# EAGLE design saomr (EAGLE 7.6.0)
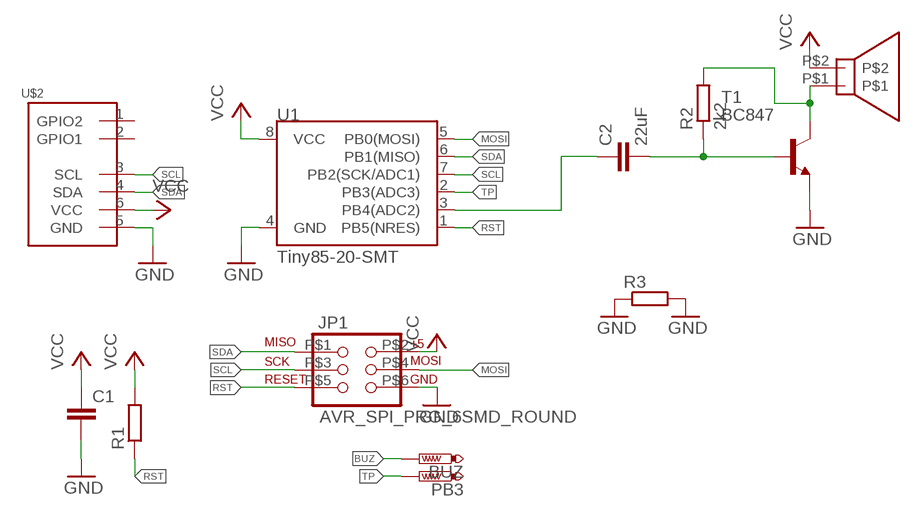
[diagram p0: schematic, sheet 1]

## Parts
BUZ  PTR1B2,54  [B2,54]
C1  C-EUC1206  [C1206]
C2  22uF  C-EUC1206  [C1206]
JP1  AVR_SPI_PRG_6SMD_ROUND  [2X3_SMD_PAD_ROUND]
PB3  PTR1B2,54  [B2,54]
R1  R-EU_R1206  [R1206]
R2  2k2  R-EU_R1206  [R1206]
R3  R-EU_M1206  [M1206]
T1  BC847  [SOT23]
U1  Tiny85-20-SMT  ATTINY45TINY85-20-SMT  [SO08-EIAJ]
U$1  SPEAKERKMTG-1102  [KMTG-1102]
U$2  SAO-SHITTY-ADDON  [2X3_SMD]

## Nets
BUZ: BUZ.TP C2.1 U1.3(PB4(ADC2))
GND: C1.2 JP1.P$6 R3.1 R3.2 T1.2(E) U1.4(GND) U$2.5(GND)
MOSI: JP1.P$4 U1.5(PB0(MOSI))
N$8: C2.2 R2.1 T1.1(B)
N$11: R2.2 T1.3(C) U$1.P$1
RST: JP1.P$5 R1.1 U1.1(PB5(NRES))
SCL: JP1.P$3 U1.7(PB2(SCK/ADC1)) U$2.3(SCL)
SDA: JP1.P$1 U1.6(PB1(MISO)) U$2.4(SDA)
TP: PB3.TP U1.2(PB3(ADC3))
VCC: C1.1 JP1.P$2 R1.2 U1.8(VCC) U$1.P$2 U$2.6(VCC)
Unconnected: U$2.1(GPIO2) U$2.2(GPIO1)

## Library data of the parts
BUZ PB3 = testpad:PTR1: TEST PIN
C1 = rcl:C-EU: CAPACITOR, European symbol
C2 = resistor:C-EU: CAPACITOR, European symbol
JP1 = SparkFun-Connectors:AVR_SPI_PRG_6: AVR ISP 6 Pin This is the reduced ISP connector for AVR programming. Common on Arduino. This footprint will take up less PCB space and can be used with a 10-pin to 6-pin adapter such as SKU: BOB-08508 **Special note about "TEST_POINT" package. The stop mask is on the top side, so if you want your programming test points to be on the bottom of your board, make sure to place this package on the bottom side of the board. This also ensure that the orientation to program from the bottom side will be correct.
R1 R2 = rcl:R-EU_: RESISTOR, European symbol
R3 = resistor:R-EU_: RESISTOR, European symbol
T1 = transistor:BC847: NPN TRANSISTOR
U1 = SparkFun-DigitalIC:ATTINY45: Atmel 8-pin 2/4/8kB flash uC; PROD_ID: IC-09092
U$1 = KMTG-1002:SPEAKER
U$2 = SparkFun-Connectors:SAO-SHITTY-ADDON

## Board
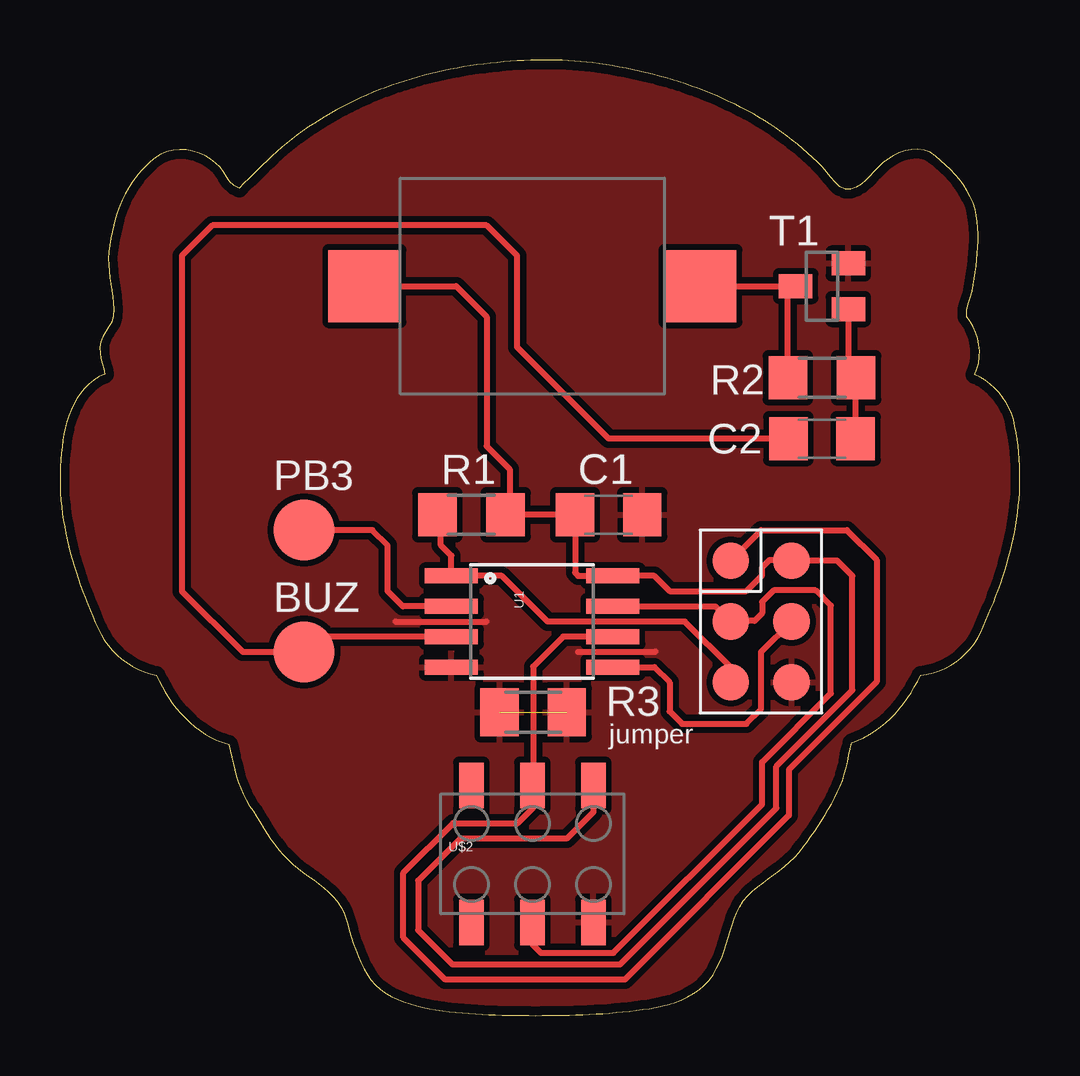
[diagram p1: board, top side]
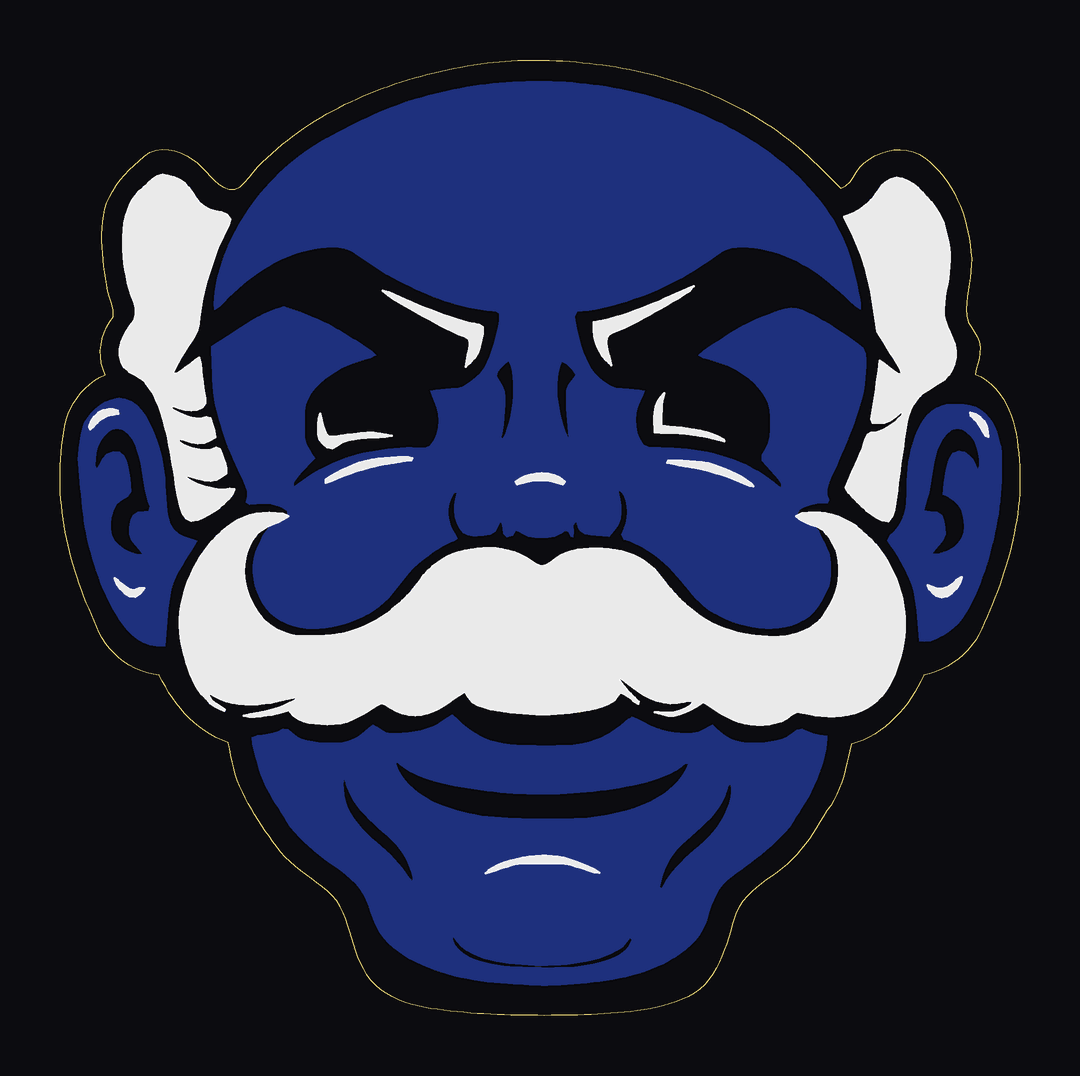
[diagram p2: board, bottom side, seen from below]

Size 40 x 39.81 mm. Coordinates in mm from the lower left corner, seen from the top.
Outline: 20.17,39.81 19.89,39.81 19.61,39.8 19.33,39.79 19.05,39.77 18.77,39.76 18.49,39.73 18.21,39.71 17.93,39.68 17.65,39.64 17.37,39.61 17.1,39.57 16.82,39.52 16.54,39.47 16.27,39.42 15.99,39.36 15.72,39.3 15.44,39.24 15.17,39.17 14.9,39.1 14.63,39.02 14.36,38.94 14.1,38.85 13.83,38.76 13.57,38.67 13.31,38.57 13.04,38.46 12.79,38.35 12.53,38.24 12.28,38.12 12.02,38 11.77,37.87 11.53,37.74 11.28,37.6 11.04,37.46 10.8,37.31 10.56,37.16 10.33,37 10.1,36.84 9.87,36.68 9.66,36.51 9.44,36.34 9.24,36.17 9.03,35.99 8.83,35.81 8.63,35.62 8.43,35.44 8.24,35.25 8.05,35.05 7.86,34.86 7.67,34.67 7.48,34.47 7.25,34.57 7.08,34.73 6.94,34.93 6.81,35.14 6.68,35.34 6.5,35.51 6.29,35.68 6.05,35.83 5.8,35.94 5.54,36.02 5.27,36.06 4.99,36.07 4.72,36.05 4.45,35.99 4.2,35.89 3.96,35.75 3.75,35.57 3.55,35.38 3.36,35.17 3.18,34.95 3.01,34.72 2.86,34.49 2.73,34.24 2.6,33.99 2.49,33.73 2.39,33.47 2.31,33.2 2.23,32.93 2.17,32.65 2.12,32.38 2.07,32.1 2.04,31.82 2.02,31.54 2.02,31.27 2.05,31.01 2.08,30.74 2.12,30.48 2.16,30.22 2.2,29.95 2.22,29.69 2.23,29.42 2.21,29.16 2.16,28.89 2.03,28.7 1.9,28.5 1.78,28.29 1.7,28.07 1.66,27.83 1.67,27.6 1.7,27.38 1.76,27.16 1.82,26.95 1.85,26.73 1.62,26.61 1.4,26.47 1.2,26.3 1.01,26.12 0.85,25.91 0.7,25.7 0.57,25.47 0.46,25.23 0.36,24.99 0.28,24.74 0.21,24.48 0.16,24.23 0.12,23.97 0.09,23.71 0.05,23.43 0.03,23.15 0.01,22.87 0,22.59 0,22.31 0.01,22.03 0.02,21.75 0.04,21.47 0.07,21.19 0.1,20.91 0.14,20.64 0.19,20.36 0.24,20.09 0.3,19.81 0.36,19.54 0.43,19.27 0.51,19 0.59,18.73 0.67,18.46 0.76,18.19 0.85,17.93 0.94,17.67 1.04,17.4 1.15,17.14 1.25,16.88 1.36,16.63 1.48,16.37 1.59,16.12 1.71,15.86 1.85,15.63 2.01,15.42 2.18,15.21 2.37,15.03 2.58,14.85 2.79,14.69 3.02,14.55 3.26,14.43 3.5,14.32 3.76,14.24 4.01,14.17 4.13,13.93 4.25,13.69 4.39,13.46 4.53,13.23 4.69,13.01 4.85,12.8 5.03,12.59 5.21,12.4 5.41,12.21 5.61,12.04 5.83,11.88 6.05,11.73 6.28,11.59 6.53,11.48 6.78,11.38 7.03,11.29 7.09,11.03 7.15,10.76 7.21,10.5 7.28,10.24 7.35,9.98 7.43,9.72 7.53,9.47 7.64,9.22 7.76,8.98 7.89,8.74 8.05,8.52 8.19,8.28 8.33,8.05 8.48,7.81 8.63,7.58 8.79,7.35 8.95,7.13 9.12,6.91 9.3,6.7 9.49,6.5 9.69,6.31 9.9,6.13 10.12,5.96 10.35,5.81 10.57,5.66 10.78,5.5 10.99,5.33 11.19,5.15 11.37,4.96 11.54,4.76 11.69,4.54 11.82,4.31 11.92,4.06 11.98,3.8 12.06,3.53 12.14,3.26 12.23,3 12.32,2.73 12.42,2.47 12.53,2.21 12.65,1.96 12.8,1.72 12.96,1.49 13.14,1.28 13.34,1.09 13.57,0.92 13.81,0.79 14.07,0.67 14.33,0.58 14.59,0.49 14.85,0.41 15.12,0.35 15.39,0.29 15.67,0.24 15.94,0.2 16.21,0.16 16.49,0.13 16.76,0.11 17.04,0.09 17.32,0.07 17.59,0.05 17.87,0.04 18.15,0.03 18.42,0.01 18.7,0.01 18.98,0 19.26,0 19.54,0 19.82,0 20.1,0 20.38,0 20.66,0.01 20.94,0.01 21.22,0.02 21.5,0.03 21.78,0.04 22.06,0.05 22.34,0.06 22.62,0.08 22.89,0.1 23.17,0.13 23.45,0.15 23.73,0.18 24.01,0.21 24.28,0.25 24.56,0.29 24.84,0.34 25.11,0.4 25.38,0.47 25.65,0.56 25.91,0.66 26.17,0.78 26.41,0.92 26.64,1.08 26.85,1.26 27.04,1.47 27.21,1.69 27.35,1.94 27.47,2.19 27.58,2.44 27.68,2.7 27.76,2.97 27.84,3.24 27.92,3.5 28.01,3.77 28.1,4.03 28.21,4.29 28.33,4.54 28.48,4.77 28.65,4.99 28.85,5.19 29.07,5.36 29.29,5.53 29.52,5.7 29.75,5.87 29.97,6.04 30.19,6.22 30.4,6.4 30.61,6.6 30.8,6.8 30.97,7.02 31.13,7.24 31.29,7.46 31.44,7.68 31.59,7.91 31.74,8.13 31.88,8.36 32.01,8.59 32.15,8.83 32.27,9.07 32.39,9.31 32.51,9.55 32.61,9.8 32.69,10.06 32.76,10.32 32.82,10.58 32.87,10.84 32.93,11.11 32.99,11.37 33.25,11.47 33.5,11.58 33.74,11.71 33.97,11.86 34.19,12.02 34.4,12.2 34.6,12.39 34.8,12.58 34.98,12.79 35.15,13 35.31,13.23 35.46,13.46 35.6,13.69 35.73,13.93 35.86,14.18 36.12,14.21 36.38,14.27 36.64,14.36 36.88,14.46 37.11,14.59 37.34,14.74 37.55,14.9 37.74,15.09 37.92,15.28 38.09,15.49 38.23,15.72 38.36,15.95 38.48,16.19 38.57,16.44 38.68,16.7 38.79,16.95 38.9,17.21 39,17.47 39.1,17.73 39.19,17.99 39.28,18.25 39.37,18.52 39.45,18.78 39.52,19.05 39.59,19.32 39.66,19.59 39.72,19.86 39.77,20.14 39.82,20.41 39.86,20.69 39.9,20.96 39.93,21.24 39.96,21.51 39.98,21.79 39.99,22.07 40,22.35 40,22.63 39.99,22.9 39.98,23.18 39.95,23.46 39.92,23.74 39.89,24.01 39.84,24.29 39.79,24.56 39.73,24.83 39.65,25.07 39.55,25.31 39.43,25.53 39.29,25.75 39.13,25.95 38.96,26.14 38.76,26.31 38.56,26.46 38.34,26.59 38.11,26.7 38.2,26.94 38.27,27.18 38.31,27.44 38.31,27.7 38.29,27.96 38.24,28.21 38.16,28.46 38.06,28.69 37.93,28.92 37.78,29.12 37.79,29.39 37.85,29.66 37.93,29.91 38.01,30.17 38.04,30.44 38.09,30.7 38.13,30.96 38.17,31.23 38.2,31.49 38.23,31.75 38.25,32.02 38.26,32.28 38.26,32.55 38.25,32.81 38.22,33.08 38.18,33.34 38.13,33.6 38.06,33.86 37.94,34.11 37.8,34.35 37.65,34.59 37.48,34.82 37.3,35.03 37.12,35.24 36.92,35.44 36.71,35.62 36.49,35.8 36.26,35.96 36.01,36.05 35.74,36.09 35.48,36.08 35.21,36.03 34.96,35.95 34.72,35.83 34.5,35.69 34.28,35.52 34.09,35.34 33.91,35.15 33.74,34.97 33.57,34.79 33.39,34.64 33.18,34.51 32.95,34.43 32.71,34.44 32.49,34.54 32.29,34.73 32.11,34.93 31.94,35.14 31.76,35.36 31.58,35.56 31.37,35.74 31.16,35.93 30.95,36.11 30.74,36.29 30.52,36.47 30.29,36.64 30.07,36.81 29.83,36.97 29.6,37.13 29.36,37.28 29.12,37.42 28.88,37.56 28.63,37.7 28.38,37.83 28.13,37.96 27.87,38.08 27.62,38.2 27.36,38.31 27.1,38.42 26.84,38.53 26.57,38.63 26.31,38.72 26.04,38.81 25.77,38.9 25.5,38.98 25.23,39.06 24.96,39.14 24.69,39.21 24.42,39.28 24.14,39.34 23.87,39.4 23.59,39.46 23.31,39.52 23.03,39.57 22.76,39.61 22.48,39.66 22.2,39.7 21.95,39.73 21.69,39.75 21.44,39.77 21.19,39.79 20.93,39.8 20.68,39.81 20.43,39.81 20.17,39.81
Copper layers (1*16): Top 0.0356mm / dielectric 1.5011mm / Bottom 0.0356mm
Design rules "LaenPCBOrder *": minimum track width 6mil, minimum drill 13mil, track to track 6mil, track to pad 6mil, pad to pad 6mil, via to via 6mil, smd to smd 6mil, copper to edge 15mil, drill to drill 6mil, minimum pad ring 7mil, minimum via ring 7mil, stop-mask expansion 3mil, vias tented up to drill 200mil, thermal gap 10mil

### Footprints (pad centres in the part's own frame; a part is rotated, then mirrored left to right if it is on the bottom)
B2,54 = smd 2.54 x 2.54: TP 0,0
C1206 = smd 1.6 x 1.8: 1 -1.4,0; 2 1.4,0
2X3_SMD_PAD_ROUND = smd 1.524 x 1.524: P$1 -1.27,2.54; P$2 1.27,2.54; P$3 -1.27,0; P$4 1.27,0; P$5 -1.27,-2.54; P$6 1.27,-2.54
R1206 = smd 1.6 x 1.803: 1 -1.422,0; 2 1.422,0
M1206 = smd 1.6 x 2: 1 -1.4,0; 2 1.4,0
SOT23 = smd 1 x 1.4: 1 -0.95,-1.1; 2 0.95,-1.1; 3 0,1.1
SO08-EIAJ = smd 0.61 x 2.21: 1 -1.905,-3.378; 2 -0.635,-3.378; 3 0.635,-3.378; 4 1.905,-3.378; 5 1.905,3.353; 6 0.635,3.353; 7 -0.635,3.353; 8 -1.905,3.353
KMTG-1102 = smd 3 x 3: P$1 -7,0; P$2 7,0
2X3_SMD = smd 1.02 x 1.9: 1 -2.54,-2.85; 2 -2.54,2.85; 3 0,-2.85; 4 0,2.85; 5 2.54,-2.85; 6 2.54,2.85

### Placement (x,y rotation side)
BUZ  10.16,15.15 0 top
C1  22.86,20.86 0 top
C2  31.75,24.04 0 top
JP1  29.21,16.42 0 top
PB3  10.16,20.23 0 top
R1  17.14,20.86 0 top
R2  31.75,26.58 180 top
R3  19.71,12.63 0 top
T1  31.75,30.39 90 top
U1  19.68,16.42 270 top
U$1  19.68,30.39 180 top
U$2  19.68,6.73 0 top
U$3  [DAVEDARKO_GOLD]  12.39,9.24 0 top

### Tracks (layer width: path | path; a pad name or v marks a point on that pad's centre or on a via)
BUZ
  Top 0.254: U1.3 10.79,15.78 BUZ.TP 7.62,15.15 5.08,17.69 5.08,31.66 6.35,32.93 17.78,32.93 19.05,31.66 19.05,27.85 22.86,24.04 C2.1
GND  (1 unrouted)
  Top 0.254: 21.59,15.15 24.78,15.15 24.8,15.17 | 13.97,16.42 17.78,16.42
  pour Top (isolate 0.254): -1.27,41.82 40.64,41.82 40.64,-0.09 -1.27,-0.09
MOSI
  Top 0.254: U1.5 24.76,14.51 25.4,13.88 25.4,12.67 25.92,12.15 28.59,12.15 29.21,12.77 29.21,15.15 JP1.P$4
N$1
  pour Bottom: 20.04,38.93 19.76,38.93 19.48,38.93 19.2,38.92 18.92,38.9 18.64,38.88 18.36,38.85 18.08,38.82 17.8,38.79 17.52,38.75 17.24,38.71 16.96,38.66 16.69,38.61 16.41,38.55 16.14,38.49 15.86,38.43 15.59,38.36 15.32,38.28 15.05,38.2 14.78,38.12 14.51,38.03 14.25,37.94 13.98,37.84 13.72,37.74 13.46,37.64 13.2,37.53 12.95,37.41 12.69,37.29 12.44,37.17 12.19,37.04 11.94,36.9 11.7,36.77 11.45,36.62 11.21,36.47 10.98,36.32 10.75,36.16 10.52,36 10.29,35.83 10.07,35.66 9.85,35.48 9.64,35.3 9.43,35.11 9.23,34.92 9.03,34.72 8.83,34.51 8.65,34.3 8.46,34.09 8.29,33.87 8.12,33.64 7.96,33.41 7.81,33.17 7.67,32.94 7.55,32.71 7.43,32.47 7.31,32.22 7.21,31.98 7.13,31.73 7.06,31.48 6.99,31.23 6.92,30.97 6.86,30.72 6.81,30.46 6.75,30.21 6.7,29.95 6.66,29.69 6.65,29.44 6.87,29.58 7.07,29.76 7.27,29.94 7.47,30.13 7.67,30.31 7.88,30.49 8.09,30.66 8.31,30.82 8.53,30.98 8.76,31.13 9,31.27 9.24,31.4 9.49,31.52 9.74,31.62 10,31.72 10.26,31.8 10.52,31.87 10.79,31.92 11.06,31.96 11.3,31.99 11.55,32 11.8,31.99 12.04,31.96 12.28,31.89 12.5,31.78 12.7,31.64 12.93,31.48 13.16,31.32 13.4,31.17 13.64,31.02 13.88,30.87 14.12,30.73 14.37,30.59 14.62,30.46 14.87,30.34 15.12,30.22 15.37,30.12 15.62,30.02 15.87,29.92 16.13,29.83 16.39,29.75 16.64,29.67 16.9,29.59 17.17,29.52 17.43,29.46 17.69,29.41 17.96,29.36 18.23,29.34 18.47,29.31 18.57,29.11 18.54,28.87 18.49,28.63 18.43,28.38 18.37,28.13 18.29,27.89 18.22,27.64 18.12,27.4 18.01,27.17 17.88,26.95 17.78,26.82 18.58,26.82 18.65,26.92 18.85,27.11 19.09,27.24 19.11,27.23 19.2,27.02 19.24,26.82 21.14,26.82 21.14,26.84 21.19,27.07 21.31,27.28 21.48,27.15 21.63,27 21.78,26.83 21.78,26.82 22.43,26.82 22.29,27 22.18,27.23 22.08,27.47 21.99,27.72 21.91,27.96 21.84,28.21 21.77,28.47 21.72,28.72 21.68,28.97 21.68,29.23 21.8,29.33 21.96,29.34 22.22,29.36 22.47,29.4 22.72,29.45 22.97,29.5 23.22,29.56 23.47,29.62 23.72,29.69 23.96,29.77 24.21,29.86 24.46,29.95 24.7,30.05 24.95,30.15 25.19,30.26 25.43,30.38 25.66,30.49 25.9,30.62 26.13,30.74 26.36,30.88 26.58,31.01 26.81,31.15 27.03,31.3 27.25,31.44 27.46,31.6 27.67,31.74 27.9,31.86 28.14,31.95 28.39,31.99 28.64,32 28.9,31.99 29.15,31.96 29.42,31.92 29.7,31.87 29.97,31.8 30.23,31.71 30.49,31.62 30.75,31.51 31,31.39 31.25,31.26 31.49,31.12 31.72,30.97 31.95,30.81 32.17,30.64 32.39,30.47 32.6,30.28 32.8,30.1 33,29.9 33.18,29.73 33.35,29.56 33.55,29.41 33.58,29.65 33.56,29.9 33.53,30.15 33.49,30.4 33.44,30.65 33.38,30.9 33.31,31.16 33.22,31.42 33.13,31.68 33.03,31.94 32.92,32.19 32.8,32.44 32.68,32.68 32.54,32.92 32.41,33.16 32.26,33.39 32.11,33.62 31.95,33.85 31.78,34.07 31.61,34.28 31.43,34.49 31.25,34.7 31.06,34.89 30.86,35.09 30.66,35.28 30.46,35.46 30.25,35.64 30.03,35.8 29.81,35.96 29.59,36.11 29.36,36.26 29.13,36.4 28.89,36.54 28.66,36.68 28.42,36.81 28.18,36.94 27.94,37.06 27.7,37.18 27.45,37.3 27.2,37.41 26.96,37.53 26.71,37.63 26.46,37.74 26.21,37.84 25.95,37.94 25.7,38.03 25.44,38.11 25.18,38.19 24.91,38.27 24.65,38.34 24.38,38.41 24.12,38.47 23.85,38.53 23.58,38.59 23.31,38.64 23.05,38.69 22.77,38.73 22.5,38.77 22.23,38.81 21.96,38.84 21.69,38.86 21.41,38.89 21.14,38.9 20.87,38.92 20.59,38.93 20.32,38.93
N$2
  pour Bottom: 30.68,29.55 30.44,29.47 30.2,29.39 29.96,29.3 29.73,29.22 29.51,29.12 29.29,29.03 29.07,28.93 28.85,28.82 28.64,28.7 28.4,28.57 28.17,28.43 27.94,28.29 27.71,28.15 27.48,28 27.25,27.85 27.03,27.7 26.83,27.52 27.07,27.4 27.32,27.32 27.58,27.24 27.83,27.16 28.08,27.05 28.32,26.94 28.55,26.81 28.78,26.66 28.99,26.5 29.19,26.33 29.38,26.14 29.54,25.92 29.68,25.69 29.77,25.45 29.82,25.18 29.83,24.92 29.83,24.65 29.83,24.37 29.82,24.09 29.75,23.81 29.61,23.57 29.5,23.39 29.39,23.22 29.53,23.08 29.66,22.94 29.79,22.8 29.96,22.61 30.13,22.42 30.28,22.21 30.29,22.02 30.06,22.15 29.86,22.3 29.63,22.47 29.4,22.62 29.16,22.77 28.91,22.9 28.66,23.02 28.4,23.12 28.14,23.22 27.88,23.31 27.61,23.39 27.36,23.44 27.11,23.49 26.85,23.54 26.6,23.57 26.34,23.61 26.09,23.63 25.83,23.66 25.57,23.67 25.31,23.68 25.06,23.66 24.79,23.65 24.55,23.77 24.39,23.99 24.28,24.24 24.22,24.51 24.2,24.79 24.22,25.06 24.28,25.33 24.38,25.59 24.47,25.81 24.56,26.04 24.35,26.08 24.13,26.1 23.92,26.12 23.69,26.13 23.47,26.15 23.25,26.2 23.05,26.31 22.86,26.44 22.65,26.6 22.45,26.79 22.44,26.81 21.78,26.81 21.83,26.63 21.69,26.43 21.57,26.22 21.5,25.99 21.47,25.75 21.47,25.47 21.48,25.19 21.51,24.92 21.54,24.64 21.58,24.36 21.64,24.09 21.55,24.02 21.44,24.23 21.34,24.48 21.27,24.75 21.2,25.01 21.15,25.28 21.12,25.56 21.09,25.83 21.09,26.1 21.09,26.35 21.11,26.59 21.13,26.81 19.24,26.81 19.25,26.78 19.28,26.55 19.3,26.31 19.3,26.07 19.29,25.83 19.26,25.58 19.22,25.32 19.17,25.08 19.11,24.83 19.05,24.58 18.97,24.34 18.86,24.11 18.78,24.07 18.8,24.28 18.83,24.53 18.85,24.78 18.87,25.04 18.88,25.29 18.89,25.55 18.89,25.8 18.88,26.06 18.8,26.27 18.66,26.46 18.56,26.57 18.49,26.69 18.57,26.81 17.78,26.81 17.73,26.75 17.54,26.57 17.34,26.41 17.11,26.26 16.85,26.16 16.58,26.13 16.3,26.12 16.08,26.1 15.87,26.08 15.66,26.03 15.75,25.81 15.85,25.6 15.95,25.35 16.01,25.09 16.03,24.82 16.02,24.55 15.96,24.29 15.86,24.04 15.72,23.81 15.49,23.7 15.22,23.68 14.96,23.67 14.7,23.66 14.42,23.65 14.14,23.63 13.86,23.61 13.58,23.57 13.3,23.53 13.03,23.48 12.76,23.42 12.49,23.35 12.22,23.27 11.95,23.18 11.69,23.07 11.44,22.96 11.19,22.83 10.95,22.7 10.71,22.55 10.48,22.38 10.26,22.21 10.09,22.08 9.92,21.97 9.92,22.15 10.05,22.34 10.2,22.52 10.36,22.69 10.55,22.9 10.73,23.12 10.74,23.37 10.58,23.6 10.47,23.86 10.41,24.13 10.39,24.41 10.39,24.69 10.39,24.96 10.41,25.22 10.46,25.48 10.57,25.73 10.71,25.95 10.88,26.16 11.06,26.35 11.26,26.52 11.47,26.68 11.7,26.82 11.93,26.95 12.17,27.07 12.42,27.16 12.67,27.25 12.92,27.32 13.17,27.39 13.39,27.51 13.18,27.69 12.95,27.86 12.71,28.01 12.48,28.17 12.24,28.32 12,28.47 11.76,28.61 11.52,28.75 11.27,28.89 11.02,29 10.77,29.11 10.51,29.21 10.25,29.3 10.02,29.38 9.79,29.45 9.55,29.49 9.31,29.47 9.08,29.4 8.86,29.3 8.64,29.19 8.39,29.06 8.15,28.92 7.92,28.77 7.68,28.62 7.45,28.47 7.21,28.32 6.98,28.16 6.76,28 6.54,27.82 6.45,27.58 6.43,27.32 6.43,27.07 6.44,26.81 6.47,26.55 6.49,26.3 6.54,26.02 6.6,25.75 6.67,25.47 6.75,25.21 6.84,24.94 6.93,24.67 7.03,24.41 7.13,24.15 7.24,23.89 7.35,23.63 7.46,23.37 7.57,23.11 7.69,22.85 7.8,22.6 7.9,22.38 7.98,22.16 8.04,21.93 8.05,21.69 7.98,21.47 8.03,21.35 8.2,21.35 8.47,21.32 8.73,21.26 8.99,21.19 9.22,21.06 9.32,20.81 9.15,20.67 8.96,20.55 8.76,20.45 8.55,20.38 8.4,20.22 8.33,20.04 8.25,19.87 8.16,19.69 8.06,19.49 7.97,19.28 7.92,19.05 7.91,18.82 7.91,18.59 7.91,18.36 7.92,18.13 7.98,17.9 8.06,17.68 8.17,17.47 8.29,17.23 8.44,17.01 8.61,16.8 8.8,16.62 9.02,16.46 9.26,16.34 9.51,16.24 9.78,16.18 10.05,16.13 10.33,16.12 10.6,16.12 10.88,16.14 11.15,16.18 11.42,16.23 11.69,16.3 11.95,16.39 12.21,16.5 12.46,16.61 12.7,16.75 12.94,16.9 13.16,17.06 13.33,17.21 13.49,17.37 13.64,17.54 13.79,17.71 13.93,17.89 14.09,18.09 14.25,18.28 14.42,18.47 14.6,18.65 14.78,18.83 14.98,18.99 15.17,19.15 15.38,19.3 15.6,19.43 15.82,19.56 16.04,19.66 16.27,19.76 16.5,19.83 16.6,20.02 16.49,20.28 16.41,20.5 16.36,20.74 16.35,20.98 16.36,21.22 16.4,21.45 16.49,21.67 16.59,21.81 16.73,21.9 16.73,21.78 16.67,21.51 16.64,21.24 16.64,20.97 16.66,20.69 16.76,20.43 16.92,20.2 17.03,20.08 17.13,19.96 17.39,19.97 17.66,19.99 17.88,20.01 18.11,20.05 18.3,20.18 18.38,20.31 18.42,20.45 18.49,20.62 18.63,20.43 18.62,20.16 18.63,19.93 18.7,19.95 18.79,20.13 18.96,20.19 19.14,20.08 19.39,19.95 19.66,19.9 19.94,19.9 20.22,19.9 20.49,19.95 20.74,20.08 20.87,20.16 21.02,20.19 21.15,19.99 21.37,19.93 21.51,20.08 21.54,20.3 21.56,20.5 21.68,20.57 21.76,20.38 21.88,20.16 22.1,20.03 22.35,19.98 22.61,19.97 22.81,19.97 23,20 23.17,20.1 23.34,20.3 23.46,20.53 23.53,20.77 23.56,21.03 23.55,21.29 23.5,21.54 23.45,21.79 23.59,21.77 23.72,21.55 23.8,21.33 23.85,21.1 23.84,20.87 23.81,20.63 23.73,20.41 23.63,20.2 23.54,20.03 23.45,19.86 23.62,19.77 23.79,19.68 23.96,19.59 24.2,19.46 24.44,19.32 24.66,19.16 24.88,18.99 25.09,18.82 25.29,18.63 25.49,18.44 25.66,18.23 25.83,18.01 25.99,17.8 26.16,17.59 26.33,17.39 26.52,17.2 26.73,17.03 26.94,16.87 27.17,16.73 27.41,16.6 27.65,16.49 27.9,16.39 28.15,16.31 28.41,16.24 28.67,16.18 28.94,16.14 29.2,16.12 29.47,16.11 29.74,16.12 30.01,16.16 30.27,16.22 30.52,16.31 30.76,16.43 30.99,16.57 31.19,16.75 31.37,16.94 31.53,17.16 31.66,17.39 31.77,17.64 31.85,17.91 31.92,18.18 31.95,18.46 31.95,18.74 31.91,19.02 31.85,19.3 31.75,19.56 31.62,19.81 31.53,20 31.41,20.18 31.27,20.34 31.09,20.49 30.9,20.6 30.69,20.7 30.49,20.8 30.5,21.02 30.69,21.13 30.84,21.19 30.99,21.24 31.19,21.29 31.4,21.32 31.61,21.32 31.83,21.3 32.09,21.28 32.25,21.39 32.18,21.61 32.18,21.84 32.25,22.07 32.35,22.28 32.45,22.49 32.56,22.72 32.66,22.95 32.77,23.18 32.87,23.42 32.96,23.65 33.05,23.89 33.13,24.13 33.21,24.38 33.28,24.62 33.35,24.86 33.43,25.13 33.5,25.41 33.56,25.68 33.6,25.96 33.62,26.24 33.63,26.52 33.64,26.8 33.65,27.07 33.66,27.34 33.67,27.61 33.68,27.88 33.48,28.01 33.28,28.14 33.09,28.27 32.89,28.39 32.67,28.54 32.44,28.69 32.21,28.83 31.98,28.97 31.75,29.11 31.51,29.23 31.27,29.35 31.01,29.44 30.85,29.5
N$3
  pour Bottom: 37.55,25.74 37.28,25.7 37.03,25.59 36.81,25.42 36.62,25.22 36.45,24.99 36.31,24.76 36.19,24.51 36.09,24.25 35.99,23.99 35.9,23.73 35.82,23.47 35.76,23.2 35.71,22.93 35.67,22.65 35.64,22.38 35.63,22.11 35.61,21.83 35.6,21.56 35.58,21.29 35.55,21.02 35.5,20.76 35.5,20.73 37,20.73 36.96,20.83 36.75,20.99 36.49,21.02 36.27,21.03 36.25,21.22 36.32,21.42 36.39,21.68 36.44,21.94 36.48,22.2 36.52,22.46 36.56,22.73 36.61,23 36.67,23.26 36.75,23.52 36.85,23.77 36.98,24.01 37.14,24.23 37.35,24.39 37.61,24.45 37.82,24.4 38.01,24.29 38.2,24.12 38.35,23.91 38.44,23.67 38.5,23.42 38.54,23.17 38.54,22.92 38.46,22.74 38.35,22.96 38.23,23.2 38.04,23.4 37.79,23.52 37.52,23.49 37.35,23.32 37.24,23.1 37.18,22.86 37.13,22.62 37.1,22.38 37.06,22.1 37.05,21.83 37.2,21.61 37.44,21.47 37.65,21.3 37.79,21.07 37.86,20.81 37.88,20.73 39,20.73 39.02,20.89 39.05,21.16 39.08,21.42 39.1,21.69 39.12,21.95 39.15,22.22 39.17,22.48 39.2,22.74 39.22,23 39.23,23.18 39.23,23.36 39.2,23.63 39.16,23.91 39.11,24.18 39.05,24.45 39.01,24.59 38.97,24.73 38.83,24.93 38.68,25.11 38.5,25.28 38.32,25.44 38.11,25.56 37.89,25.66 37.65,25.72
N$4
  pour Bottom: 2.87,25.48 2.71,25.47 2.55,25.47 2.32,25.46 2.08,25.44 1.86,25.36 1.66,25.24 1.47,25.09 1.3,24.92 1.16,24.72 1.04,24.51 0.96,24.28 0.9,24.04 0.86,23.87 0.81,23.7 0.77,23.46 0.78,23.25 0.78,23.04 0.78,22.83 0.78,22.55 0.78,22.28 0.79,22 0.81,21.73 0.84,21.46 0.85,21.37 2.65,21.37 2.72,21.43 2.91,21.56 3.06,21.63 3.2,21.7 3.18,21.94 3.15,22.18 3.12,22.45 3.07,22.71 3.01,22.97 2.92,23.22 2.77,23.45 2.56,23.53 2.33,23.48 2.13,23.35 1.97,23.17 1.87,22.96 1.77,22.74 1.67,22.91 1.68,23.16 1.71,23.41 1.77,23.67 1.87,23.91 2.02,24.12 2.21,24.29 2.41,24.4 2.62,24.45 2.88,24.38 3.08,24.21 3.24,24.01 3.36,23.79 3.46,23.55 3.54,23.31 3.6,23.06 3.64,22.81 3.68,22.56 3.71,22.3 3.76,22.04 3.81,21.78 3.88,21.53 3.93,21.37 4.73,21.37 4.72,21.45 4.7,21.73 4.7,22.01 4.7,22.27 4.68,22.54 4.66,22.8 4.62,23.06 4.58,23.32 4.52,23.58 4.46,23.83 4.37,24.08 4.28,24.33 4.16,24.57 4.03,24.79 3.87,25 3.68,25.19 3.46,25.33 3.27,25.42 3.08,25.46
N$5
  pour Bottom: 0.85,21.36 0.87,21.18 0.91,20.91 0.96,20.64 1.01,20.37 1.06,20.1 1.12,19.83 1.19,19.57 1.26,19.3 1.33,19.04 1.41,18.77 1.49,18.51 1.58,18.25 1.68,17.99 1.78,17.74 1.89,17.49 2.01,17.24 2.13,16.99 2.27,16.76 2.43,16.53 2.6,16.32 2.8,16.13 3.01,15.97 3.24,15.83 3.47,15.7 3.72,15.6 3.99,15.57 4.18,15.59 4.2,15.84 4.22,16.09 4.24,16.34 4.26,16.59 4.29,16.86 4.32,17.14 4.35,17.41 4.4,17.68 4.48,17.94 4.58,18.19 4.7,18.43 4.82,18.67 4.95,18.91 5.08,19.14 5.22,19.37 5.39,19.58 5.52,19.79 5.4,20 5.23,20.18 5.04,20.39 4.9,20.63 4.8,20.9 4.75,21.17 4.73,21.36 3.93,21.36 3.95,21.29 4.01,21.06 3.88,21.02 3.73,21.02 3.47,20.99 3.27,20.83 3.17,20.59 3.13,20.33 3.12,20.06 3.21,19.81 3.38,19.6 3.53,19.42 3.67,19.24 3.41,19.24 3.16,19.32 2.93,19.41 2.72,19.54 2.54,19.7 2.41,19.9 2.33,20.13 2.3,20.37 2.32,20.62 2.36,20.84 2.44,21.07 2.55,21.27 2.64,21.36
N$6
  pour Bottom: 35.49,20.72 35.42,20.5 35.29,20.27 35.09,20.09 34.84,19.97 34.59,19.89 34.44,19.84 34.29,19.79 34.4,19.59 34.52,19.39 34.65,19.2 34.79,18.97 34.94,18.74 35.07,18.51 35.19,18.27 35.3,18.02 35.38,17.76 35.43,17.49 35.47,17.23 35.5,16.96 35.52,16.69 35.55,16.42 35.57,16.16 35.59,15.9 35.61,15.64 35.63,15.38 35.8,15.38 35.98,15.39 36.26,15.42 36.52,15.53 36.76,15.67 36.98,15.85 37.17,16.05 37.35,16.27 37.51,16.5 37.66,16.74 37.8,16.98 37.93,17.23 38.06,17.48 38.17,17.74 38.27,18 38.37,18.26 38.47,18.53 38.55,18.8 38.63,19.05 38.71,19.31 38.77,19.57 38.84,19.83 38.89,20.09 38.94,20.36 38.98,20.62 38.99,20.72 37.88,20.72 37.9,20.54 37.91,20.28 37.87,20.03 37.75,19.81 37.58,19.62 37.37,19.47 37.18,19.37 36.97,19.29 36.76,19.23 36.55,19.23 36.69,19.42 36.84,19.6 37.01,19.81 37.1,20.06 37.09,20.33 37.05,20.59 37,20.72
N$7
  pour Bottom: 23.65,12.53 23.46,12.35 23.28,12.18 23.06,12 22.84,11.84 22.6,11.69 22.35,11.57 22.09,11.48 21.82,11.4 21.54,11.35 21.26,11.31 20.99,11.28 20.71,11.27 20.43,11.26 20.15,11.25 19.87,11.25 19.59,11.25 19.32,11.25 19.04,11.26 18.77,11.27 18.49,11.29 18.22,11.34 17.95,11.41 17.71,11.49 17.48,11.58 17.25,11.69 17.03,11.81 16.81,11.95 16.61,12.1 16.42,12.27 16.3,12.38 16.17,12.45 15.99,12.39 15.82,12.3 15.65,12.21 15.42,12.1 15.18,12 14.93,11.91 14.68,11.85 14.43,11.8 14.17,11.77 13.91,11.76 13.64,11.77 13.38,11.82 13.13,11.94 12.98,12.03 12.83,12.12 12.68,11.98 12.53,11.84 12.33,11.68 12.11,11.55 11.87,11.46 11.63,11.4 11.38,11.37 11.12,11.36 10.87,11.37 10.62,11.39 10.37,11.42 10.12,11.47 9.88,11.53 9.65,11.63 9.45,11.77 9.29,11.91 9.09,11.95 8.89,11.86 8.63,11.76 8.36,11.7 8.2,11.68 8.04,11.65 8.05,11.51 8.06,11.37 8.1,11.1 8.15,10.84 8.22,10.57 8.31,10.31 8.4,10.06 8.5,9.81 8.61,9.56 8.72,9.32 12.01,9.32 12.01,9.39 12.02,9.53 12.08,9.65 12.17,9.54 12.22,9.4 12.25,9.32 14.72,9.32 14.61,9.4 14.4,9.59 14.21,9.79 14.05,10.01 13.9,10.24 13.8,10.49 13.97,10.49 14.12,10.37 14.33,10.2 14.58,10.07 14.83,9.96 15.09,9.87 15.35,9.78 15.61,9.71 15.88,9.64 16.15,9.58 16.42,9.53 16.69,9.48 16.97,9.44 17.24,9.4 17.52,9.36 17.79,9.33 18.07,9.3 18.34,9.28 18.62,9.26 18.89,9.24 19.17,9.23 19.45,9.22 19.72,9.21 20,9.21 20.28,9.21 20.55,9.22 20.83,9.23 21.11,9.25 21.38,9.26 21.66,9.29 21.93,9.32 22.2,9.35 22.48,9.38 22.75,9.42 23.02,9.46 23.29,9.51 23.55,9.55 23.82,9.61 24.09,9.67 24.35,9.74 24.61,9.82 24.87,9.91 25.12,10.01 25.37,10.13 25.6,10.28 25.82,10.44 25.98,10.57 25.99,10.57 26.01,10.48 25.93,10.24 25.8,10.03 25.65,9.83 25.49,9.64 25.31,9.46 25.11,9.3 24.89,9.16 24.67,9.03 24.44,8.91 24.21,8.81 23.97,8.72 23.72,8.63 23.48,8.56 23.23,8.49 22.98,8.43 22.73,8.38 22.45,8.33 22.17,8.3 21.9,8.28 21.62,8.26 21.34,8.24 21.07,8.23 20.79,8.22 20.51,8.21 20.23,8.2 19.95,8.2 19.68,8.2 19.4,8.2 19.12,8.2 18.84,8.2 18.56,8.21 18.29,8.23 18.01,8.25 17.73,8.28 17.45,8.32 17.18,8.37 16.9,8.42 16.63,8.49 16.36,8.56 16.09,8.64 15.83,8.73 15.57,8.83 15.31,8.95 15.07,9.08 14.83,9.23 14.73,9.31 12.25,9.31 12.3,9.14 12.42,8.89 12.57,8.65 12.73,8.43 12.91,8.22 13.11,8.03 13.31,7.83 13.51,7.65 13.72,7.47 13.93,7.29 14.12,7.12 14.29,6.93 14.45,6.73 14.59,6.52 14.71,6.3 14.82,6.07 14.9,5.83 14.98,5.6 15.02,5.37 14.93,5.29 14.83,5.45 14.74,5.61 14.6,5.82 14.44,6.02 14.27,6.21 14.1,6.39 13.92,6.57 13.73,6.75 13.54,6.92 13.35,7.08 13.14,7.26 12.94,7.45 12.76,7.66 12.59,7.87 12.44,8.1 12.3,8.34 12.19,8.59 12.09,8.85 12.03,9.11 12.02,9.31 8.73,9.31 8.85,9.07 8.99,8.84 9.13,8.61 9.25,8.44 9.36,8.26 9.46,8.07 9.62,7.85 9.8,7.64 9.99,7.44 10.19,7.25 10.39,7.06 10.6,6.88 10.81,6.7 11.02,6.52 11.24,6.36 11.47,6.2 11.66,6.06 11.85,5.92 12.04,5.78 12.22,5.63 12.39,5.47 12.54,5.26 12.67,5.04 12.78,4.8 12.88,4.57 12.97,4.32 13.04,4.08 13.12,3.81 13.24,3.57 13.39,3.33 13.56,3.12 13.75,2.92 13.9,2.79 16.37,2.79 16.25,2.94 16.16,3.15 16.25,3.24 16.4,3.05 16.58,2.85 16.67,2.79 17.44,2.79 17.44,2.78 16.68,2.78 16.79,2.69 17.03,2.57 17.28,2.46 17.54,2.37 17.8,2.3 18.07,2.24 18.33,2.19 18.6,2.15 18.87,2.12 19.14,2.1 19.41,2.09 19.68,2.08 19.96,2.08 20.23,2.08 20.5,2.09 20.77,2.11 21.03,2.13 21.3,2.16 21.56,2.2 21.82,2.25 22.08,2.3 22.33,2.37 22.58,2.46 22.83,2.57 23.05,2.7 23.26,2.87 23.44,3.06 23.53,3.19 23.64,3.3 23.66,3.17 23.57,2.94 23.41,2.75 23.22,2.59 23.01,2.46 22.79,2.36 22.54,2.28 22.28,2.21 22.03,2.16 21.77,2.11 21.51,2.08 21.26,2.05 20.99,2.04 20.73,2.02 20.47,2.01 20.21,2.01 19.94,2 19.66,2 19.38,2 19.11,2.01 18.83,2.02 18.56,2.04 18.28,2.07 18.03,2.11 17.79,2.16 17.54,2.22 17.3,2.29 17.06,2.37 16.82,2.46 16.6,2.58 16.4,2.74 16.37,2.78 13.91,2.78 13.95,2.74 14.17,2.57 14.4,2.41 14.63,2.27 14.88,2.15 15.13,2.03 15.38,1.92 15.64,1.83 15.9,1.74 16.17,1.67 16.43,1.6 16.7,1.55 16.97,1.5 17.23,1.45 17.5,1.41 17.77,1.38 18.04,1.35 18.31,1.32 18.58,1.3 18.86,1.28 19.13,1.26 19.4,1.25 19.67,1.25 19.94,1.25 20.21,1.26 20.44,1.27 20.67,1.28 20.9,1.29 21.12,1.3 21.35,1.32 21.63,1.33 21.91,1.36 22.19,1.39 22.47,1.43 22.74,1.47 23.02,1.52 23.29,1.58 23.57,1.65 23.84,1.72 24.11,1.8 24.37,1.89 24.63,1.99 24.89,2.1 25.15,2.22 25.4,2.35 25.64,2.49 25.87,2.65 26.09,2.82 26.3,3.01 26.49,3.22 26.65,3.44 26.77,3.64 26.87,3.85 26.96,4.07 27.03,4.28 27.12,4.54 27.22,4.8 27.34,5.05 27.49,5.28 27.66,5.49 27.86,5.69 28.07,5.87 28.29,6.03 28.51,6.19 28.74,6.35 28.96,6.51 29.18,6.68 29.4,6.86 29.44,6.9 26.46,6.9 26.45,6.89 26.27,6.72 26.09,6.54 25.92,6.35 25.76,6.15 25.61,5.95 25.46,5.74 25.31,5.55 25.28,5.73 25.35,6 25.44,6.25 25.56,6.5 25.68,6.72 25.81,6.93 25.97,7.12 26.15,7.3 26.33,7.47 26.52,7.64 26.71,7.81 26.9,7.98 27.09,8.16 27.27,8.34 27.44,8.53 27.6,8.73 27.75,8.94 27.87,9.16 27.95,9.34 28.02,9.52 28.07,9.71 28.15,9.87 28.17,9.88 28.17,9.88 28.21,9.67 28.2,9.44 28.17,9.17 28.11,8.91 28.02,8.66 27.91,8.42 27.76,8.2 27.6,7.98 27.43,7.78 27.24,7.59 27.04,7.41 26.85,7.23 26.64,7.06 26.47,6.91 29.45,6.91 29.61,7.04 29.81,7.23 30.01,7.43 30.21,7.63 30.39,7.84 30.54,8.07 30.64,8.26 30.75,8.44 30.87,8.63 30.99,8.8 31.13,9.04 31.27,9.28 31.4,9.53 31.51,9.78 31.61,10.03 31.69,10.29 31.77,10.54 31.84,10.8 31.91,11.06 31.96,11.32 31.98,11.59 31.77,11.68 31.54,11.71 31.33,11.73 31.11,11.78 30.91,11.85 30.71,11.94 30.51,11.92 30.35,11.78 30.16,11.63 29.94,11.53 29.71,11.46 29.47,11.42 29.23,11.39 28.99,11.37 28.73,11.36 28.47,11.37 28.21,11.39 27.96,11.45 27.71,11.54 27.49,11.67 27.28,11.84 27.12,11.98 26.95,12.11 26.79,12.03 26.65,11.93 26.44,11.81 26.21,11.77 25.97,11.77 25.73,11.78 25.47,11.8 25.2,11.84 24.94,11.89 24.69,11.96 24.44,12.06 24.21,12.18 23.98,12.32 23.81,12.42
N$8
  Top 0.254: T1.1 32.85,26.9 R2.1 33.15,26.55 C2.2
N$11
  Top 0.254: U$1.P$1 T1.3 30.33,30.06 R2.2
RST
  Top 0.254: JP1.P$5 27.94,14.51 26.03,16.42 20.32,16.42 18.41,18.32 U1.1 16.31,19.16 15.87,19.59 15.87,20.71 R1.1
SCL
  Top 0.254: U1.7 27.3,17.05 JP1.P$3 27.97,16.44 28.94,16.44 29.26,16.76 29.26,17.24 29.73,17.71 31.48,17.71 32.12,17.08 32.12,13.42 29.26,10.56 29.26,8.81 23.06,2.61 20.03,2.61 19.68,2.96 U$2.3
SDA
  Top 0.254: JP1.P$1 29.21,20.23 32.79,20.23 34.03,18.99 34.03,13.9 30.37,10.24 30.37,8.33 23.53,1.5 16.06,1.5 14.31,3.25 14.31,5.95 16.38,8.02 19.08,8.02 19.72,8.65 19.72,10.35 U$2.4 19.72,10.41 19.72,14.53 20.96,15.78 U1.6
TP
  Top 0.254: U1.2 14.29,17.05 13.65,17.69 13.65,19.59 13.02,20.23 PB3.TP
VCC
  Top 0.254: U$2.6 22.22,8.48 21.11,7.37 16.67,7.37 14.92,5.62 14.92,3.56 16.35,2.13 23.33,2.13 29.84,8.64 29.84,10.38 33.02,13.56 33.02,18.32 32.38,18.96 JP1.P$2 30.45,18.99 29.57,18.99 29.26,18.67 29.26,18.35 28.59,17.69 25.4,17.69 24.76,18.32 U1.8 21.59,18.32 21.46,18.45 C1.1 R1.2 18.73,21.03 18.73,22.77 17.78,23.72 17.78,29.12 16.51,30.39 U$1.P$2

### Text on the board
tNames: jumper
bStop: darko | dave